# Altium schematic sheet [02]-Thermistors.SchDoc: ENTER SHEET TITLE
size B; Engineer: ENTER ENGINEER NAME; Organization: CUAir; Address1: L3, 12a Rodborough Rd; Address2: Frenchs Forest; Address3: NSW; Address4: Australia 2086; Revision: ENTER REVISION NUMBER; CompetitionYear: 2019; CPN: ENTER CPN; PROJECT: ENTER PROJECT NAME
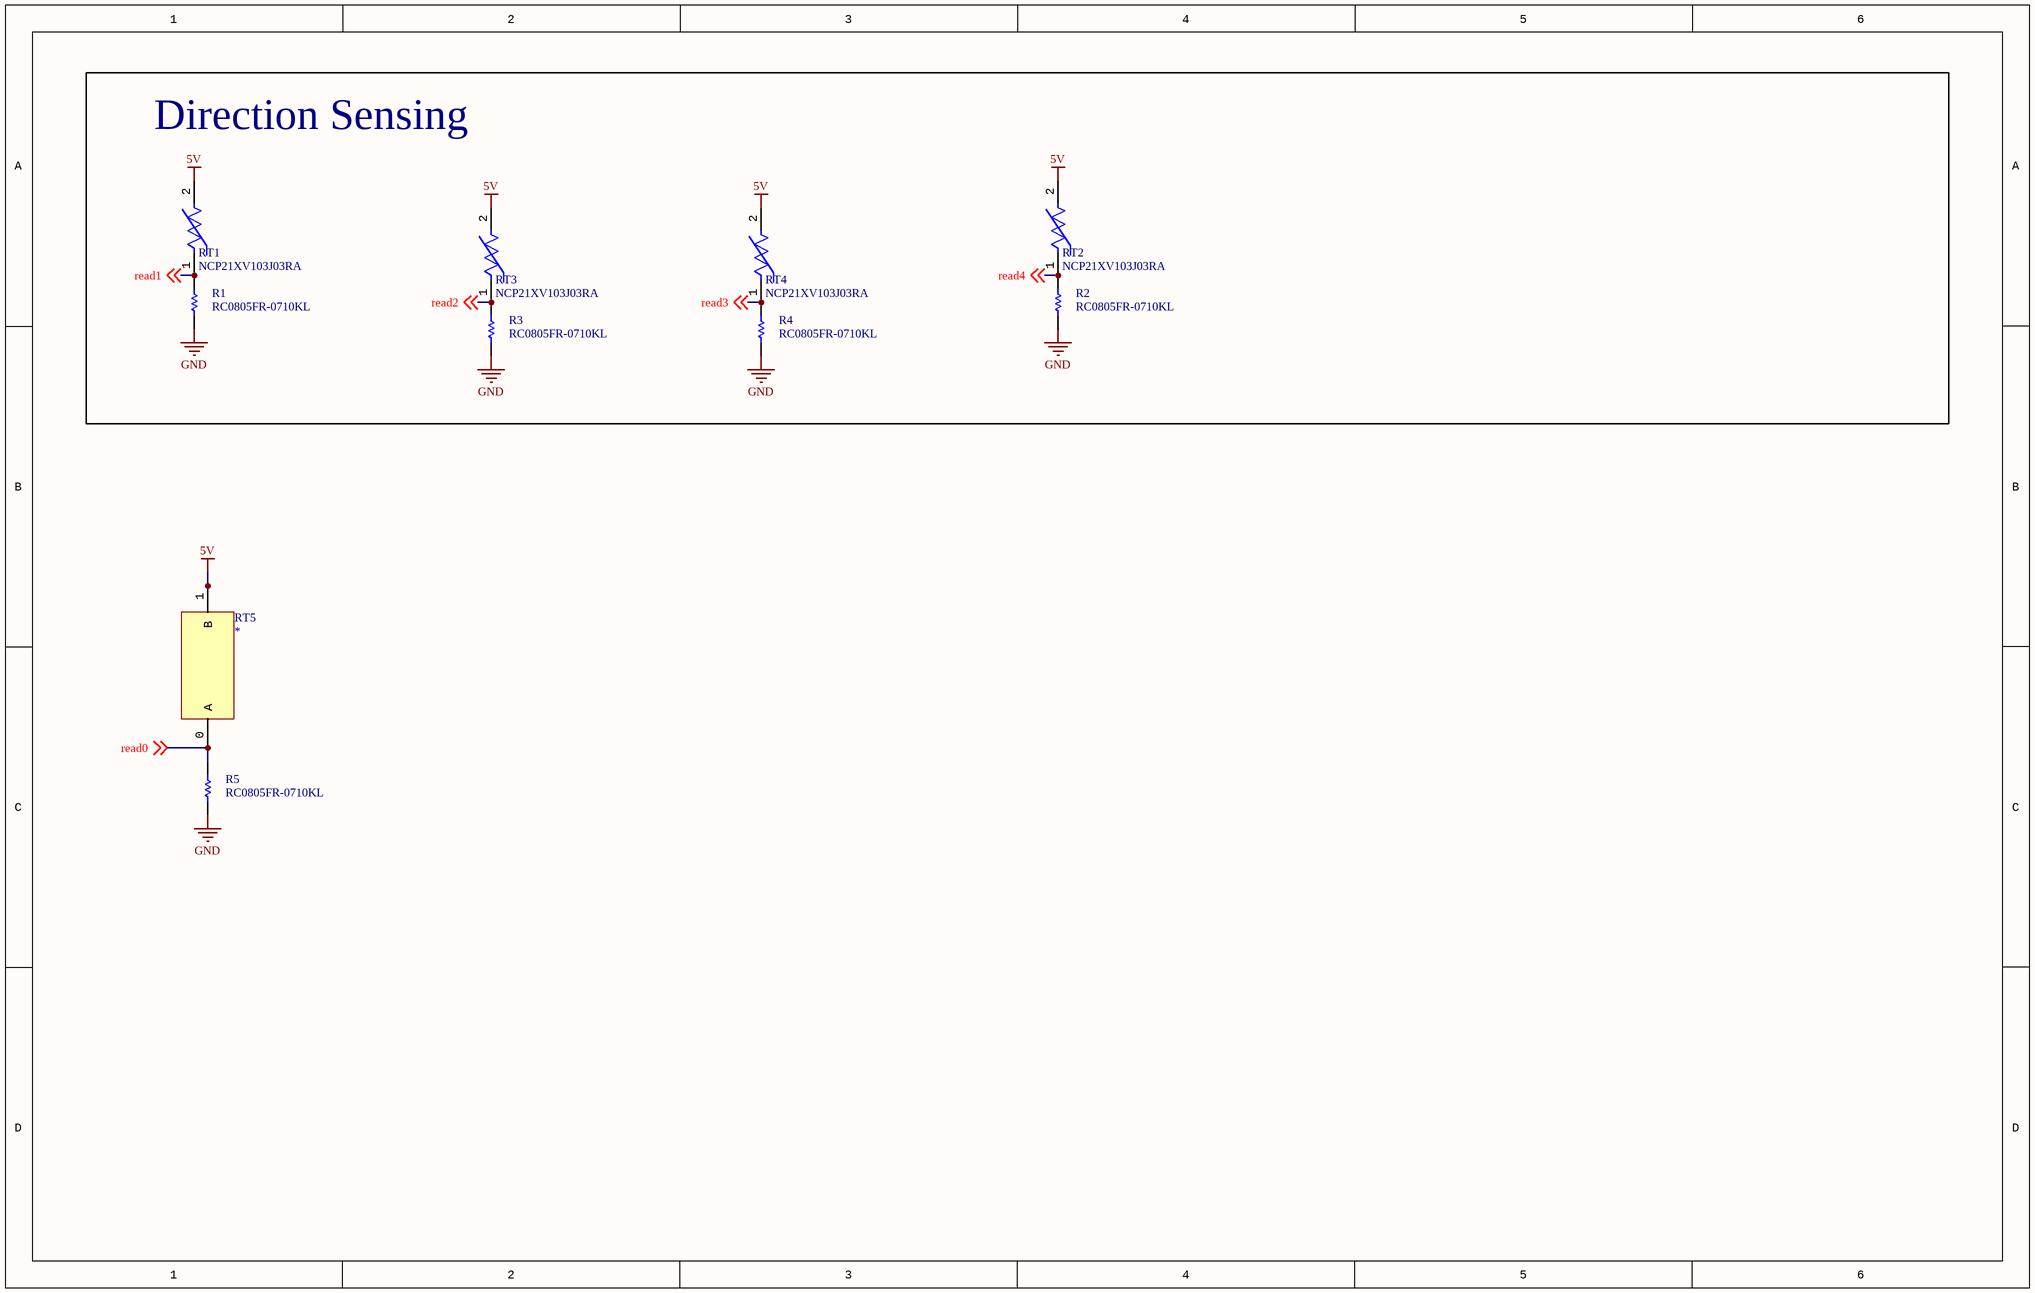
[diagram p0: [02]-Thermistors.SchDoc]

## Parts
R1  RC0805FR-0710KL  [RESC2013X60X35LL10T20]
R2  RC0805FR-0710KL  [RESC2013X60X35LL10T20]
R3  RC0805FR-0710KL  [RESC2013X60X35LL10T20]
R4  RC0805FR-0710KL  [RESC2013X60X35LL10T20]
R5  RC0805FR-0710KL  [RESC2013X60X35LL10T20]
RT1  NCP21XV103J03RA  [FP-NCP21-0_2-IPC_C]
RT2  NCP21XV103J03RA  [FP-NCP21-0_2-IPC_C]
RT3  NCP21XV103J03RA  [FP-NCP21-0_2-IPC_C]
RT4  NCP21XV103J03RA  [FP-NCP21-0_2-IPC_C]
RT5  *  [thermistor]

## Blocks framed on the sheet
Direction Sensing: R1-R4 RT1-RT4

## Nets
5V: RT1.2 RT2.2 RT3.2 RT4.2 RT5.1(B)
GND: R1.1 R2.1 R3.1 R4.1 R5.1
read0: R5.2 RT5.0(A) ; off-sheet read0
read1: R1.2 RT1.1 ; off-sheet read1
read2: R3.2 RT3.1 ; off-sheet read2
read3: R4.2 RT4.1 ; off-sheet read3
read4: R2.2 RT2.1 ; off-sheet read4

## Notes on the sheet
- Project
- Title
- Size:
- Date:
- B
- Number:
- Revision:
- File:

## Library data of the parts
R1-R5 = CMP-1659-00013-4: Chip Resistor, 10 KOhm, +/- 1%, 0.125 W, -55 to 155 degC, 0805 (2012 Metric), RoHS, Tape and Reel; Manufacturer: Yageo; Voltage Rating: 150 V; PackageReference: 0805; ComponentLink1URL: http://www.yageo.com/; ComponentLink1Description: Manufacturer URL; Mount: Surface Mount; ComponentLink2URL: http://www.yageo.com/documents/recent/PYu-RC_Group_51_RoHS_L_04.pdf; Pins: 2; Length: 2 mm; Min Operating Temperature: -55 degC; Height: 0.5 mm; Mounting Technology: Surface Mount; RoHSCompliant: true; REACH SVHC: No SVHC; Max Operating Temperature: 155 degC; DatasheetVersion: Rev. 4, 02/2016; Package Quantity: 5000; Packaging: Tape and Reel; ComponentLink2Description: Datasheet; PackageDescription: 2-Pin Surface Mounted Device, Body 2 x 1.25 mm
RT1-RT4 = CMP-2000-06827-2: THERMISTOR NTC 10KOHM 3900K 0805; Accuracy: 3%; Current Rating: 440uA; Power Rating: 200mW; Resistance: 10kR; Tolerance: 5%; Number of Pins: 2; Termination: SMD/SMT; Lead Free: Lead Free; Radiation Hardening: No; Mount: Surface Mount; Case Code (Metric): 2012; Depth: 1.25mm; Max Operating Temperature: 125°C; Height: 0.85mm; Case Code (Imperial): 0805; Package Quantity: 4000; Length: 2mm; Case/Package: 0805; Min Operating Temperature: -40°C; Packaging: Tape and Reel; Max Power Dissipation: 200mW; Thickness: 150um; REACH SVHC: No SVHC
RT5 = thermistor: MPN: *; Manufacturer: *; Value: *